# EAGLE design 1-HomeSwitch (EAGLE 7.2.0)
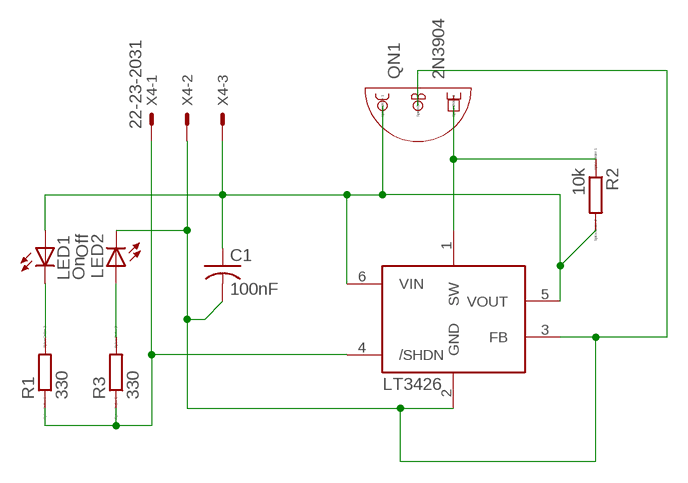
[diagram p0: schematic, sheet 1]

## Parts
C1  100nF  C-USC1210  [C1210]
IC1  74LVG1G58GV  LT3426  [SOT23-6]
LED1  On  LED5MM  [LED5MM]
LED2  Off  LED5MM  [LED5MM]
QN1  2N3904  [TO92]
R1  330  R  [R0805]
R2  10k  R  [R0805]
R3  330  R  [R0805]
X4  22-23-2031  [22-23-2031]

## Nets
GND: C1.2 IC1.2(GND) IC1.3(FB) LED2.K(C) QN1.2(B) X4.2
N$2: LED1.K(C) R1.2
N$13: C1.1 IC1.5(VOUT) IC1.6(VIN) LED1.A QN1.1(C) R2.2 X4.3
N$17: IC1.1(SW) QN1.3(E) R2.1
N$19: IC1.4(/SHDN) R1.1 R3.1 X4.1
N$20: LED2.A R3.2

## Library data of the parts
C1 = adafruit:C-US: CAPACITOR, American symbol
IC1 = adafruit:LT3426: LT3426 1.2MHz, 2A boost converter in SOT-23 http://www.linear.com/pc/productDetail.jsp?navId=H0,C1,C1003,C1042,C1031,C1061,P8430 (Linear website)
LED1 LED2 = led:LED: LED OSRAM: - CHIPLED LG R971, LG N971, LY N971, LG Q971, LY Q971, LO R971, LY R971 LH N974, LH R974 LS Q976, LO Q976, LY Q976 LO Q996 - Hyper CHIPLED LW Q18S LB Q993, LB Q99A, LB R99A - SideLED LS A670, LO A670, LY A670, LG A670, LP A670 LB A673, LV A673, LT A673, LW A673 LH A674 LY A675 LS A676, LA A676, LO A676, LY A676, LW A676 LS A679, LY A679, LG A679 - Hyper Micro SIDELED® LS Y876, LA Y876, LO Y876, LY Y876 LT Y87S - SmartLED LW L88C, LW L88S LB L89C, LB L89S, LG L890 LS L89K, LO L89K, LY L89K LS L896, LA L896, LO L896, LY L896 - TOPLED LS T670, LO T670, LY T670, LG T670, LP T670 LSG T670, LSP T670, LSY T670, LOP T670, LYG T670 LG T671, LOG T671, LSG T671 LB T673, LV T673, LT T673, LW T673 LH T674 LS T676, LA T676, LO T676, LY T676, LB T676, LH T676, LSB T676, LW T676 LB T67C, LV T67C, LT T67C, LS T67K, LO T67K, LY T67K, LW E67C LS E67B, LA E67B, LO E67B, LY E67B, LB E67C, LV E67C, LT E67C LW T67C LS T679, LY T679, LG T679 LS T770, LO T770, LY T770, LG T770, LP T770 LB T773, LV T773, LT T773, LW T773 LH T774 LS E675, LA E675, LY E675, LS T675 LS T776, LA T776, LO T776, LY T776, LB T776 LHGB T686 LT T68C, LB T68C - Hyper Mini TOPLED® LB M676 - Mini TOPLED Santana® LG M470 LS M47K, LO M47K, LY M47K Source: http://www.osram.convergy.de LUXEON: - LUMILED® LXK2-PW12-R00, LXK2-PW12-S00, LXK2-PW14-U00, LXK2-PW14-V00 LXK2-PM12-R00, LXK2-PM12-S00, LXK2-PM14-U00 LXK2-PE12-Q00, LXK2-PE12-R00, LXK2-PE12-S00, LXK2-PE14-T00, LXK2-PE14-U00 LXK2-PB12-K00, LXK2-PB12-L00, LXK2-PB12-M00, LXK2-PB14-N00, LXK2-PB14-P00, LXK2-PB14-Q00 LXK2-PR12-L00, LXK2-PR12-M00, LXK2-PR14-Q00, LXK2-PR14-R00 LXK2-PD12-Q00, LXK2-PD12-R00, LXK2-PD12-S00 LXK2-PH12-R00, LXK2-PH12-S00 LXK2-PL12-P00, LXK2-PL12-Q00, LXK2-PL12-R00 Source: www.luxeon.com KINGBRIGHT: KA-3528ASYC Source: www.kingbright.com
QN1 = PAsystem:2N3904: TO-92
R1-R3 = eagle-ltspice:R: RESISTOR, European symbol; SPICEMODEL: NONE; SPICEPREFIX: R
X4 = con-molex:22-23-2031: .100" (2.54mm) Center Header - 3 Pin; MF: MOLEX; MPN: 22-23-2031; OC_FARNELL: 1462950; OC_NEWARK: 30C0862

## Net classes
0 default: width 0.711 mm, drill 0.508 mm, clearance 0.254 mm

## Board
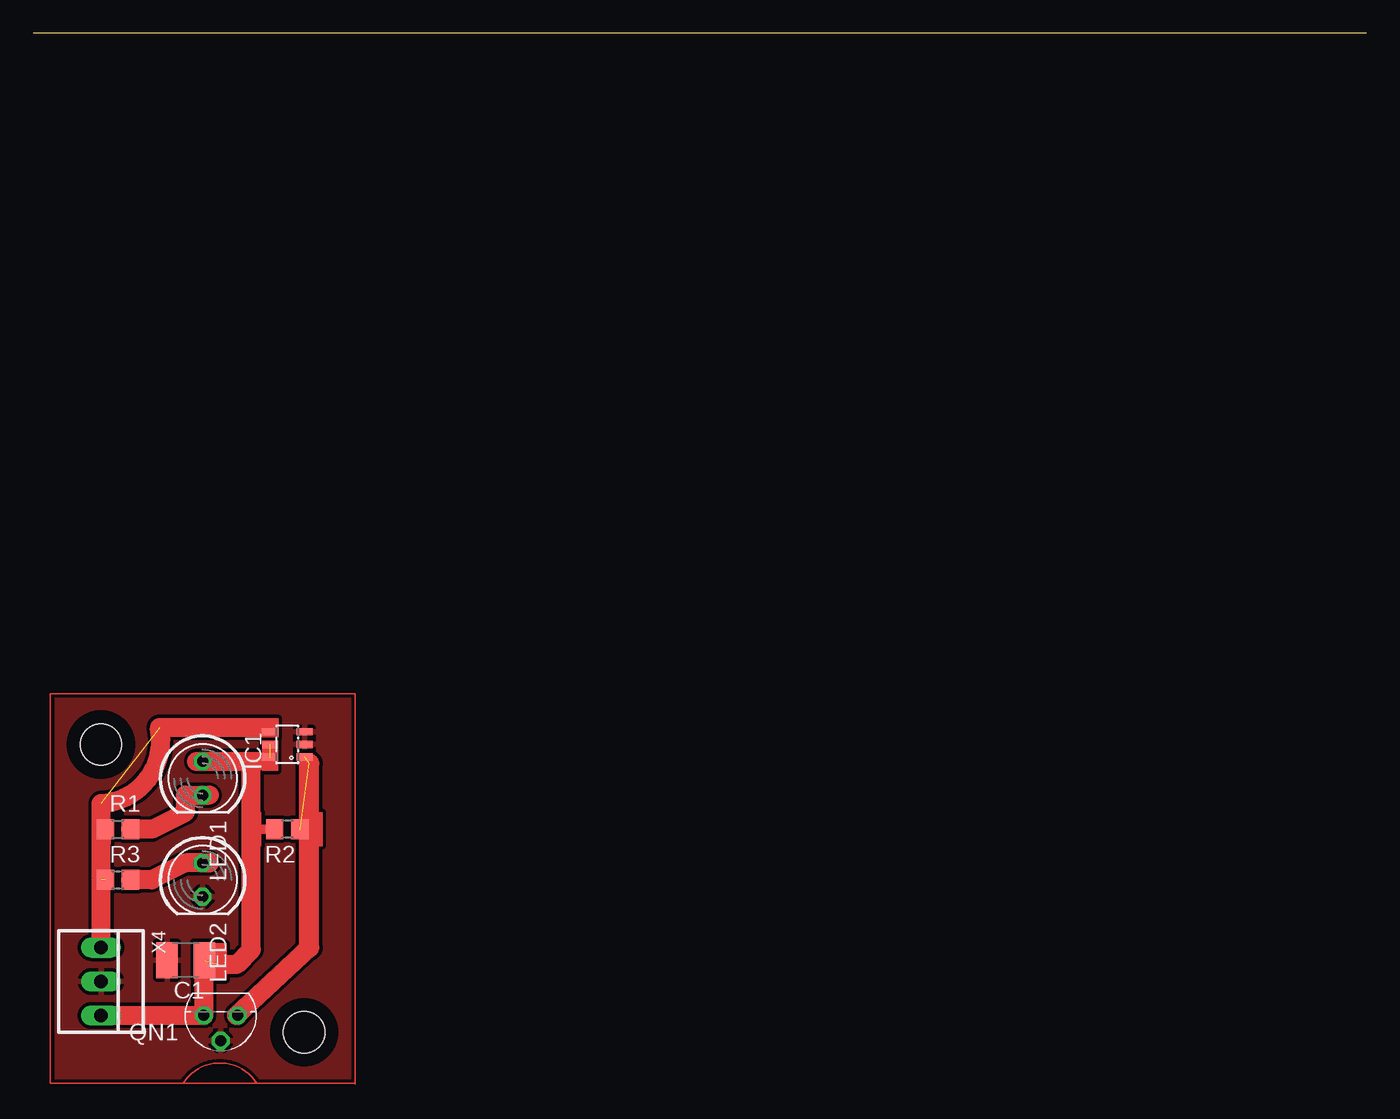
[diagram p1: board, top side]
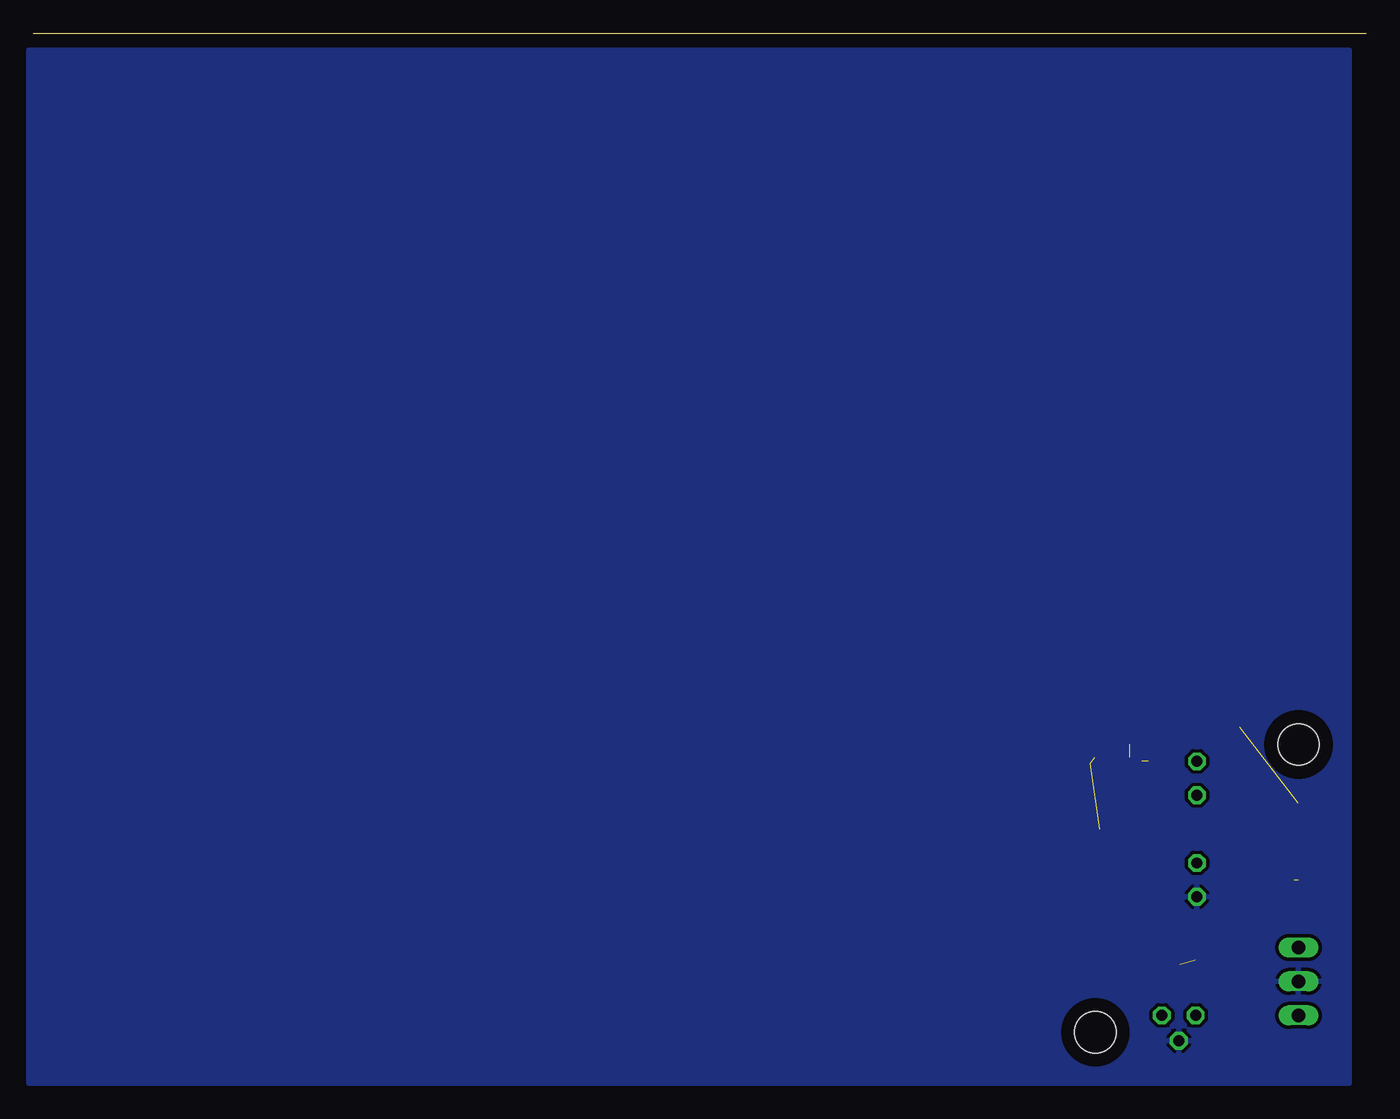
[diagram p2: board, bottom side, seen from below]

Size 100 x 0 mm. Coordinates in mm from the lower left corner, seen from the top.
Outline: 100,0 0,0
Copper layers (1*16): Top 0.035mm / dielectric 1.5mm / Bottom 0.035mm
Design rules "14 pin sop *": minimum track width 10mil, minimum drill 24mil, track to track 0.205mm, track to pad 0.205mm, pad to pad 12mil, via to via 12mil, smd to smd 8mil, copper to edge 40mil, drill to drill 8mil, minimum pad ring 10mil, minimum via ring 8mil, stop-mask expansion 4mil, vias tented up to drill 0mil, thermal gap 10mil
Holes 3.1 mm at 5.08,-53.33 20.32,-74.92

### Footprints (pad centres in the part's own frame; a part is rotated, then mirrored left to right if it is on the bottom)
C1210 = smd 1.6 x 2.7: 1 -1.4,0; 2 1.4,0
SOT23-6 = smd 0.55 x 1.2: 1 -0.95,-1.3; 2 0,-1.3; 3 0.95,-1.3; 4 0.95,1.3; 5 0,1.3; 6 -0.95,1.3
LED5MM = drill 0.813 octagon: A -1.27,0; K 1.27,0
TO92 = drill 0.813 octagon: 1 1.27,0; 2 0,1.905; 3 -1.27,0
R0805 = smd 1.3 x 1.5: 1 -0.95,0; 2 0.95,0
22-23-2031 = drill 1 long: 1 -2.54,0; 2 0,0; 3 2.54,0

### Placement (x,y rotation side)
C1  11.43,-69.5 180 top  (outside the outline)
IC1  19.05,-53.33 90 top  (outside the outline)
LED1  12.7,-55.87 270 top  (outside the outline)
LED2  12.7,-63.49 270 top  (outside the outline)
QN1  14.06,-73.65 180 top  (outside the outline)
R1  6.35,-59.68 0 top  (outside the outline)
R2  19.05,-59.68 180 top  (outside the outline)
R3  6.35,-63.49 0 top  (outside the outline)
X4  5.08,-71.11 270 top  (outside the outline)

### Tracks (layer width: path | path; a pad name or v marks a point on that pad's centre or on a via)
GND
  pour Top: 1.27,-1.26 1.27,-78.73 100.33,-78.73 100.33,-1.26
  pour Bottom: 1.27,-1.26 1.27,-78.73 100.33,-78.73 100.33,-1.26
N$1
  Top 0.1: 24.13,-78.73 1.27,-78.73 1.27,-49.52 24.13,-49.52 24.13,-78.73 | 24.13,-78.73 24.13,-78.81
N$2
  Top 1.422: R1.2 8.89,-59.68 11.43,-58.41 11.43,-57.14 LED1.K 13.2,-57.14
N$3
  Top 1.422: 5.08,-57.75 arc100 9.45,-52.06
N$4
  Top 0.1: 11.25,-78.73 arc-115 16.75,-78.73
N$13  (3 unrouted)
  Top 0.711: 16.35,-59.68 R2.2 | 12.79,-69.84 C1.1
  Top 0.813: 16.83,-54.6 IC1.6
  Top 1.422: 12.79,-69.84 QN1.1 X4.3 | 16.83,-54.6 LED1.A 12.25,-54.6 | 16.35,-54.6 16.35,-59.68 16.35,-68.73 15.24,-69.84 13.97,-69.84
N$17  (2 unrouted)
  Top 1.422: QN1.3 15.24,-73.65 20.7,-68.57
  Top 1.5: 20.7,-68.57 20.7,-54.75
N$19  (2 unrouted)
  Top 0.711: 5.08,-63.49 R1.1
  Top 0.813: 16.51,-52.06 16.83,-52.38 IC1.4
  Top 1.016: R1.1 5.08,-63.17
  Top 1.422: X4.1 5.08,-63.49 | 5.08,-63.17 5.08,-57.75 | 9.5,-52.06 16.51,-52.06
N$20
  Top 1.422: R3.2 8.89,-63.49 11.43,-62.22 LED2.A 13.2,-62.22
(copper drawn outside any net)
  shapes: Top area x5